# Altium schematic sheet PCB.SchDoc
size A4; PageSetup: Record=PageOptions|CenterHorizontal=True|CenterVertical=True|PrintScale=1.00|XCorrection=1.00|YCorrection=1.00|PrintKind=0|BorderSize=5000000|LeftOffset=0|BottomOffset=0|Orientation=2|PaperLength=1000|PaperWidth=1000|Scale=100|PaperSource=7|PrintQuality=-3|MediaType=1|DitherType=10|PrintScaleMode=1|PaperKind=A4|PaperIndex=9
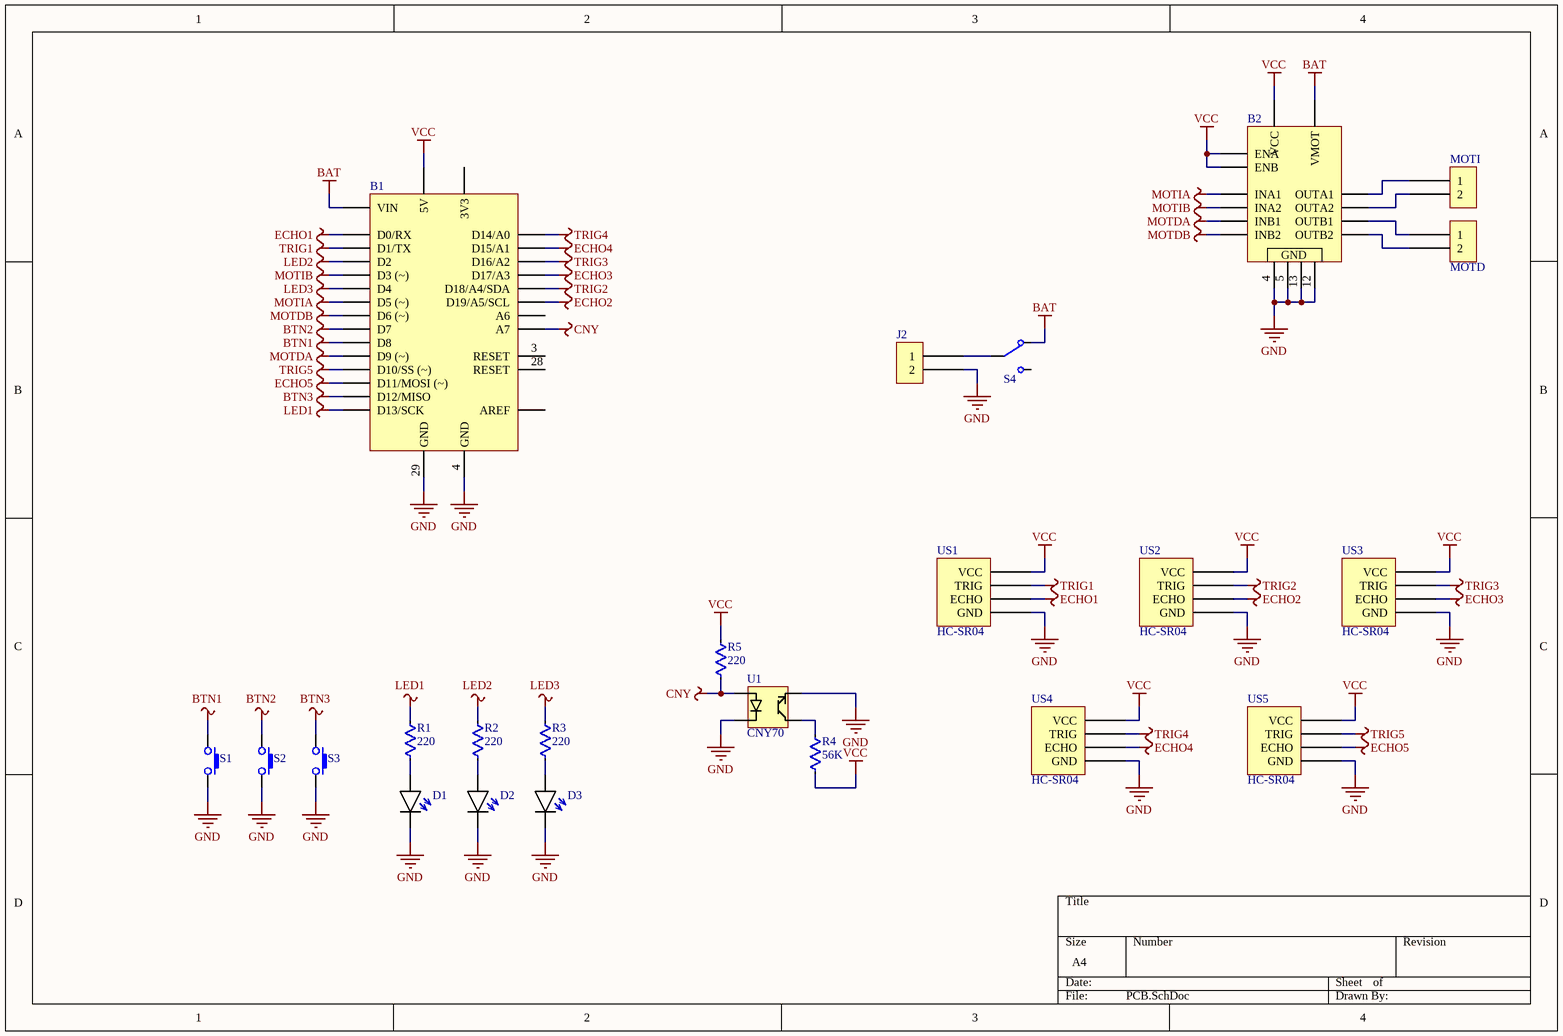
[diagram p0: PCB.SchDoc]

## Parts
B1  ARDUINO NANO  [ARDUINO NANO]  (value not drawn)
B2  L293D  [DIP16]  (value not drawn)
D1  LED  [LED-3MM-RED]  (value not drawn)
D2  LED  [LED-3MM-YELLOW]  (value not drawn)
D3  LED  [LED-3MM-GREEN]  (value not drawn)
J2  Header 1x2  [HEADER 1x2]  (value not drawn)
MOTD  Header 1x2  [HEADER 1x2]  (value not drawn)
MOTI  Header 1x2  [HEADER 1x2]  (value not drawn)
R1  value 220  [RES VERTICAL]  (hidden comment: RES)
R2  value 220  [RES-Axial-400mil]  (hidden comment: RES)
R3  value 220  [RES-Axial-400mil]  (hidden comment: RES)
R4  value 56K  [RES-Axial-400mil]  (hidden comment: RES)
R5  value 220  [RES-Axial-400mil]  (hidden comment: RES)
S1  BUTTON  [TACT_SWITCH-SMALL-4PIN]  (value not drawn)
S2  BUTTON  [TACT_SWITCH-SMALL-4PIN]  (value not drawn)
S3  BUTTON  [TACT_SWITCH-SMALL-4PIN]  (value not drawn)
S4  SLIDE-SWITCH  [SWITCH]  (value not drawn)
U1  CNY70  [CNY70]
US1  HC-SR04  [HC-SR04]
US2  HC-SR04  [HC-SR04]
US3  HC-SR04  [HC-SR04]
US4  HC-SR04  [HC-SR04]
US5  HC-SR04  [HC-SR04]

## Nets
BAT: B1.30(VIN) B2.8(VMOT) S4.1
BTN1: B1.11(D8) S1.1
BTN2: B1.10(D7) S2.1
BTN3: B1.15(D12/MISO) S3.1
CNY: B1.26(A7) R5.1 U1.A
ECHO1: B1.2(D0/RX) US1.3(ECHO)
ECHO2: B1.24(D19/A5/SCL) US2.3(ECHO)
ECHO3: B1.22(D17/A3) US3.3(ECHO)
ECHO4: B1.20(D15/A1) US4.3(ECHO)
ECHO5: B1.14(D11/MOSI_(~)) US5.3(ECHO)
GND: B1.4(GND) B1.29(GND) B2.4 B2.5 B2.12 B2.13 D1.K D2.K D3.K J2.2 S1.2 S2.2 S3.2 U1.E(7.5) U1.K US1.4(GND) US2.4(GND) US3.4(GND) US4.4(GND) US5.4(GND)
LED1: B1.16(D13/SCK) R1.2
LED2: B1.5(D2) R2.2
LED3: B1.7(D4) R3.2
MOTDA: B1.12(D9_(~)) B2.10(INB1)
MOTDB: B1.9(D6_(~)) B2.15(INB2)
MOTIA: B1.8(D5_(~)) B2.2(INA1)
MOTIB: B1.6(D3_(~)) B2.7(INA2)
TRIG1: B1.1(D1/TX) US1.2(TRIG)
TRIG2: B1.23(D18/A4/SDA) US2.2(TRIG)
TRIG3: B1.21(D16/A2) US3.2(TRIG)
TRIG4: B1.19(D14/A0) US4.2(TRIG)
TRIG5: B1.13(D10/SS_(~)) US5.2(TRIG)
VCC: B1.27(5V) B2.1(ENA) B2.9(ENB) B2.16(VCC) R4.1 R5.2 US1.1(VCC) US2.1(VCC) US3.1(VCC) US4.1(VCC) US5.1(VCC)
NetB2_3: B2.3(OUTA1) MOTI.1
NetB2_6: B2.6(OUTA2) MOTI.2
NetB2_11: B2.11(OUTB1) MOTD.1
NetB2_14: B2.14(OUTB2) MOTD.2
NetD1_A: D1.A R1.1
NetD2_A: D2.A R2.1
NetD3_A: D3.A R3.1
NetJ2_1: J2.1 S4.2
NetR4_2: R4.2 U1.C

Not connected (* = marked no-connect by the designer): B1 3(RESET) 17(3V3) 18(AREF) 25(A6) 28(RESET); S4 3

## Notes on the sheet
- (in symbol L293D) GND

## Library data of the parts
B1 = ARDUINO NANO: Allied_Number: 70518857; Geometry.Height: 7.62mm; Manufacturer_Name: Arduino; Manufacturer_Part_Number: Nano; RS Part Number: 6961667; RS Price/Stock: http://uk.rs-online.com/web/p/products/6961667; Allied Price/Stock: http://www.alliedelec.com/arduino-a000005/70518857/; Arrow Part Number: Nano; Arrow Price/Stock: http://uk.rs-online.com/web/p/products/6961667; Datasheet Link: http://docs-europe.electrocomponents.com/webdocs/0db9/0900766b80db99cb.pdf